# EAGLE design Grove-EMG Sensor v1.0 (EAGLE 6.4)
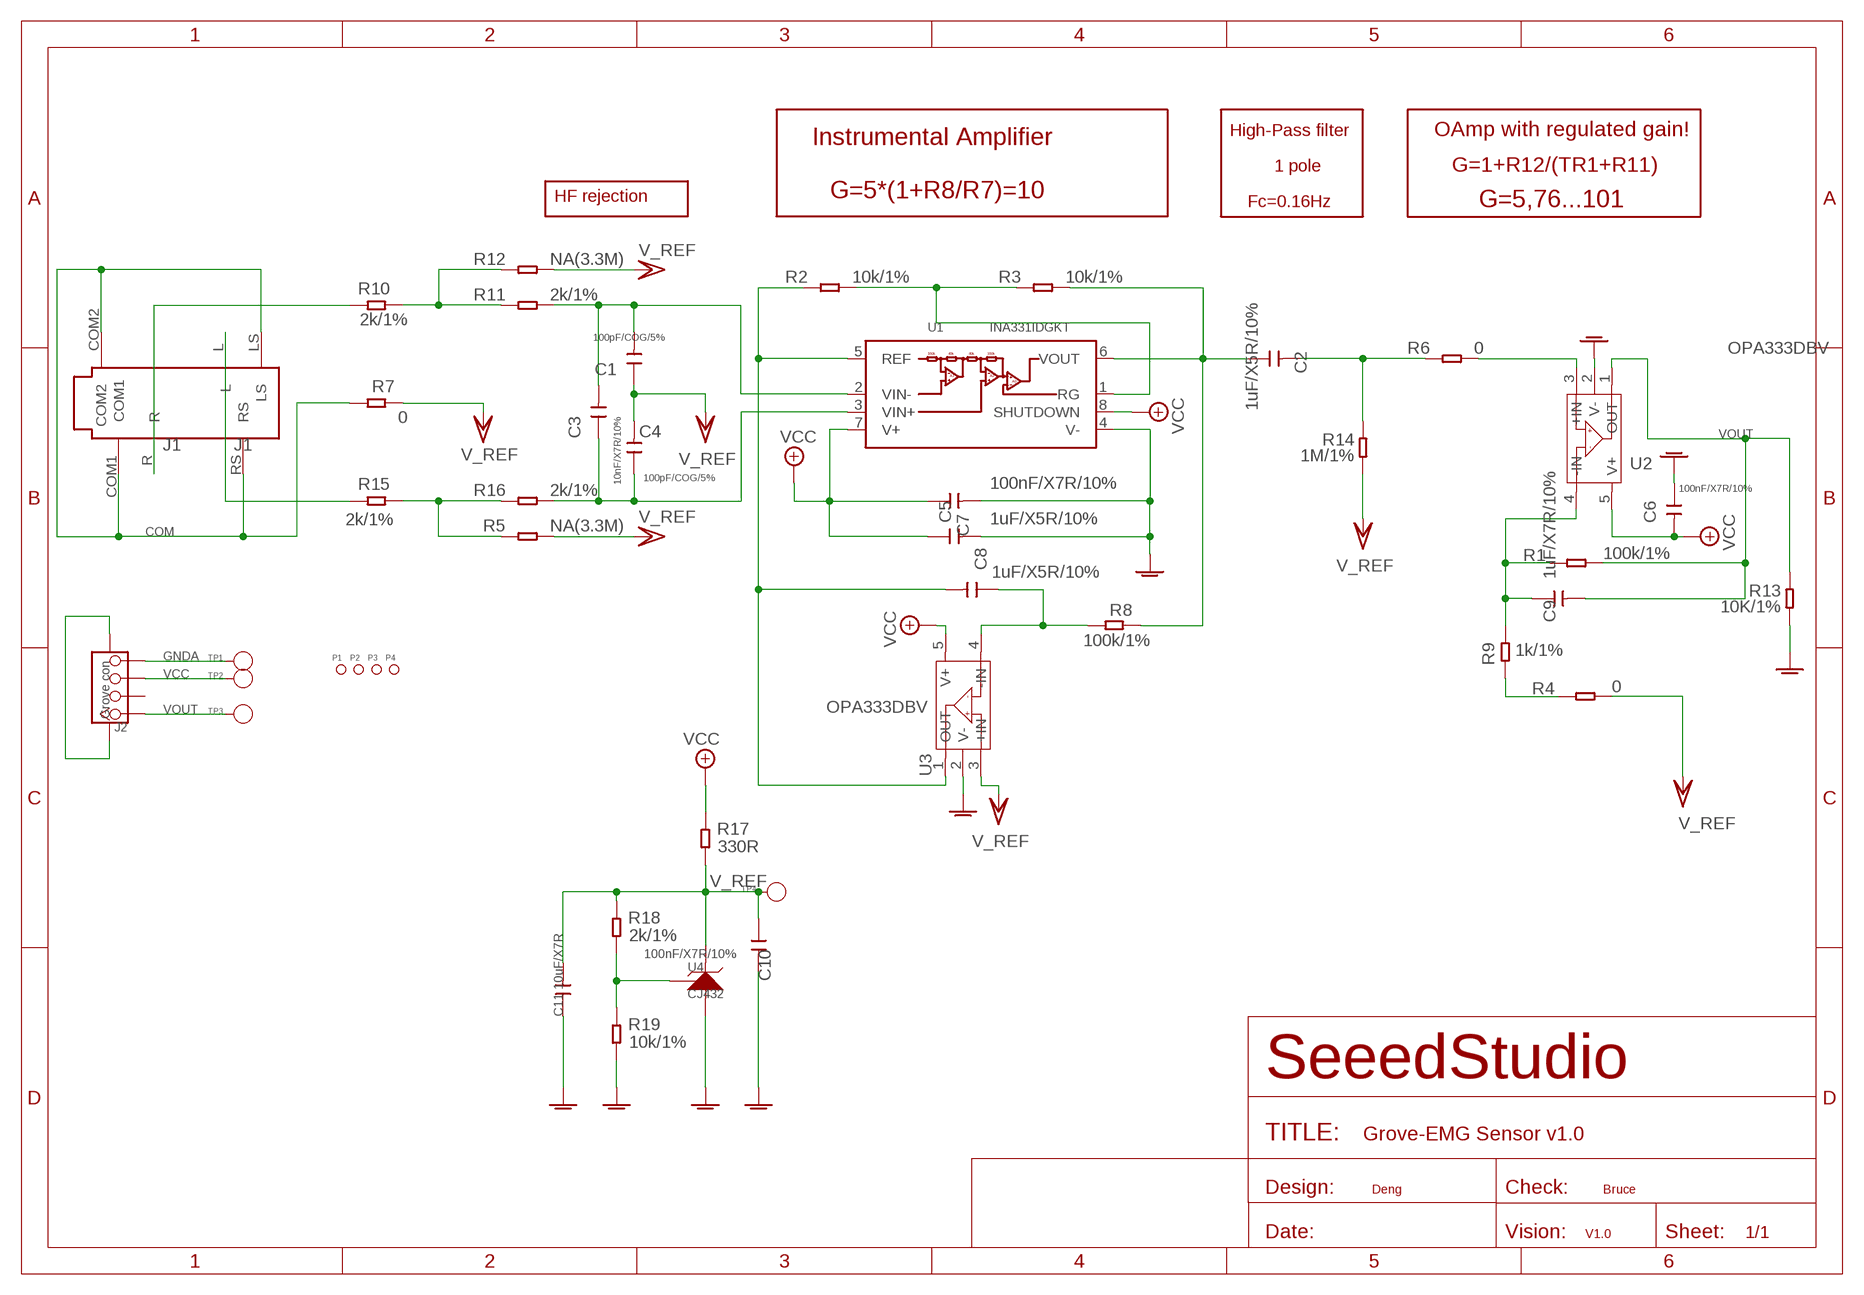
[diagram p0: schematic, sheet 1]

## Parts
C1  100pF/COG/5%  C-0603  [C0603]
C2  1uF/X5R/10%  C-0603  [C0603]
C3  10nF/X7R/10%  C-0603  [C0603]
C4  100pF/COG/5%  C-0603  [C0603]
C5  100nF/X7R/10%  C-0603  [C0603]
C6  100nF/X7R/10%  C-0603  [C0603]
C7  1uF/X5R/10%  C-0603  [C0603]
C8  1uF/X5R/10%  C-0603  [C0603]
C9  1uF/X7R/10%  C-0603  [C0603]
C10  100nF/X7R/10%  C-0603  [C0603]
C11  10uF/X7R  C-0805  [C0805]
J1  J1  AUDIO-6P-SMD  [6P-SMD-3.5-NEW]
J2  Grove con  TWIG-4P-2.0-SMD-FEMALE-REINFORCE'DD'  [4P-SMD-2.0]
P1  PAD-MARK  [ROUND-MARK-1.0]
P2  PAD-MARK  [ROUND-MARK-1.0]
P3  PAD-MARK  [ROUND-MARK-1.0]
P4  PAD-MARK  [ROUND-MARK-1.0]
R1  100k/1%  R-0603  [R0603]
R2  10k/1%  R-0603  [R0603]
R3  10k/1%  R-0603  [R0603]
R4  0  R-0603  [R0603]
R5  NA(3.3M)  R-0603  [R0603]
R6  0  R-0603  [R0603]
R7  0  R-0603  [R0603]
R8  100k/1%  R-0603  [R0603]
R9  1k/1%  R-0603  [R0603]
R10  2k/1%  R-0603  [R0603]
R11  2k/1%  R-0603  [R0603]
R12  NA(3.3M)  R-0603  [R0603]
R13  10K/1%  R-0603  [R0603]
R14  1M/1%  R-0603  [R0603]
R15  2k/1%  R-0603  [R0603]
R16  2k/1%  R-0603  [R0603]
R17  330R  R-0603  [R0603]
R18  2k/1%  R-0603  [R0603]
R19  10k/1%  R-0603  [R0603]
TP1  TP1  PAD-TEST-POINT'4545'  [TP_4545]
TP2  TP2  PAD-TEST-POINT'4545'  [TP_4545]
TP3  TP3  PAD-TEST-POINT'4545'  [TP_4545]
TP4  TP4  PAD-TEST-POINT'4545'  [TP_4545]
U1  INA331IDGKT  INA331EA  [MSOP-8]
U2  OPA333DBV  [SOT23-5]
U3  OPA333DBV  [SOT23-5]
U4  CJ432  REFERENCE-SOURCE  [SOT23]

## Nets
COM: J1.COM1 J1.COM2 J1.LS J1.RS R7.1
GNDA [pwr]: C5.2 C6.1 C7.2 C10.2 C11.1 J2.4 R13.2 R19.1 TP1.T U1.4(V-) U2.2(V-) U3.2(V-) U4.3(A)
N$1: R4.1 R9.2
N$2: C8.1 R8.1 U3.4(-IN)
N$3: J1.R R10.1
N$4: J1.L R15.1
N$7: R10.2 R11.2 R12.2
N$8: R5.2 R15.2 R16.2
N$9: C8.2 R2.2 U1.5(REF) U3.1(OUT)
N$10: R2.1 R3.2 U1.1(RG)
N$20: C2.2 R6.2 R14.1
N$22: R18.1 R19.2 U4.1(R)
N$83: C2.1 R3.1 R8.2 U1.6(VOUT)
N$92: C3.1 C4.1 R16.1 U1.3(VIN+)
N$93: C1.2 C3.2 R11.1 U1.2(VIN-)
N$102: R6.1 U2.3(+IN)
N$105: C9.1 R1.1 R9.1 U2.4(-IN)
V_REF: C1.1 C4.2 C10.1 C11.2 J2.SS1 J2.SS2 R4.2 R5.1 R7.2 R12.1 R14.2 R17.1 R18.2 TP4.T U3.3(+IN) U4.2(K)
VCC: C5.1 C6.2 C7.1 J2.3 R17.2 TP2.T U1.7(V+) U1.8(SHUTDOWN) U2.5(V+) U3.5(V+)
VOUT: C9.2 J2.1 R1.2 R13.1 TP3.T U2.1(OUT)
Unconnected: J2.2

## Notes on the sheet
- High-Pass filter | OAmp with regulated gain!
- Instrumental Amplifier
- 1 pole | G=1+R12/(TR1+R11)
- HF rejection
- G=5*(1+R8/R7)=10
- Fc=0.16Hz | G=5,76...101
- Deng | Bruce
- V1.0

## Library data of the parts
C1-C11 = Discrete:C*: Ceramic Capacitors
J1 = Connector :AUDIO-6P-SMD
J2 = Connector :TWIG-4P-2.0-SMD-FEMALE-REINFORCE
P1-P4 = Discrete:PAD-MARK; PARTNO: DNP
R1-R19 = Discrete:R*
TP1-TP4 = Discrete:PAD-TEST-POINT; PARTNO: DNP
U1 = template:INA331
U2 U3 = IC:OPA333: 1.8V,Micro power CMOS oprational amplifiers Zero-Drift Series http://www.ti.com.cn/cn/lit/ds/symlink/opa333.pdf
U4 = For_Test_Albert_v6:REFERENCE-SOURCE: CJ432,AZ432 or other Adjustable Reference Source

## Net classes
0 default: width 0.152 mm, drill 0.305 mm, clearance 0.152 mm
1 pwr: width 0.152 mm, drill 0.305 mm, clearance 0.152 mm

## Board
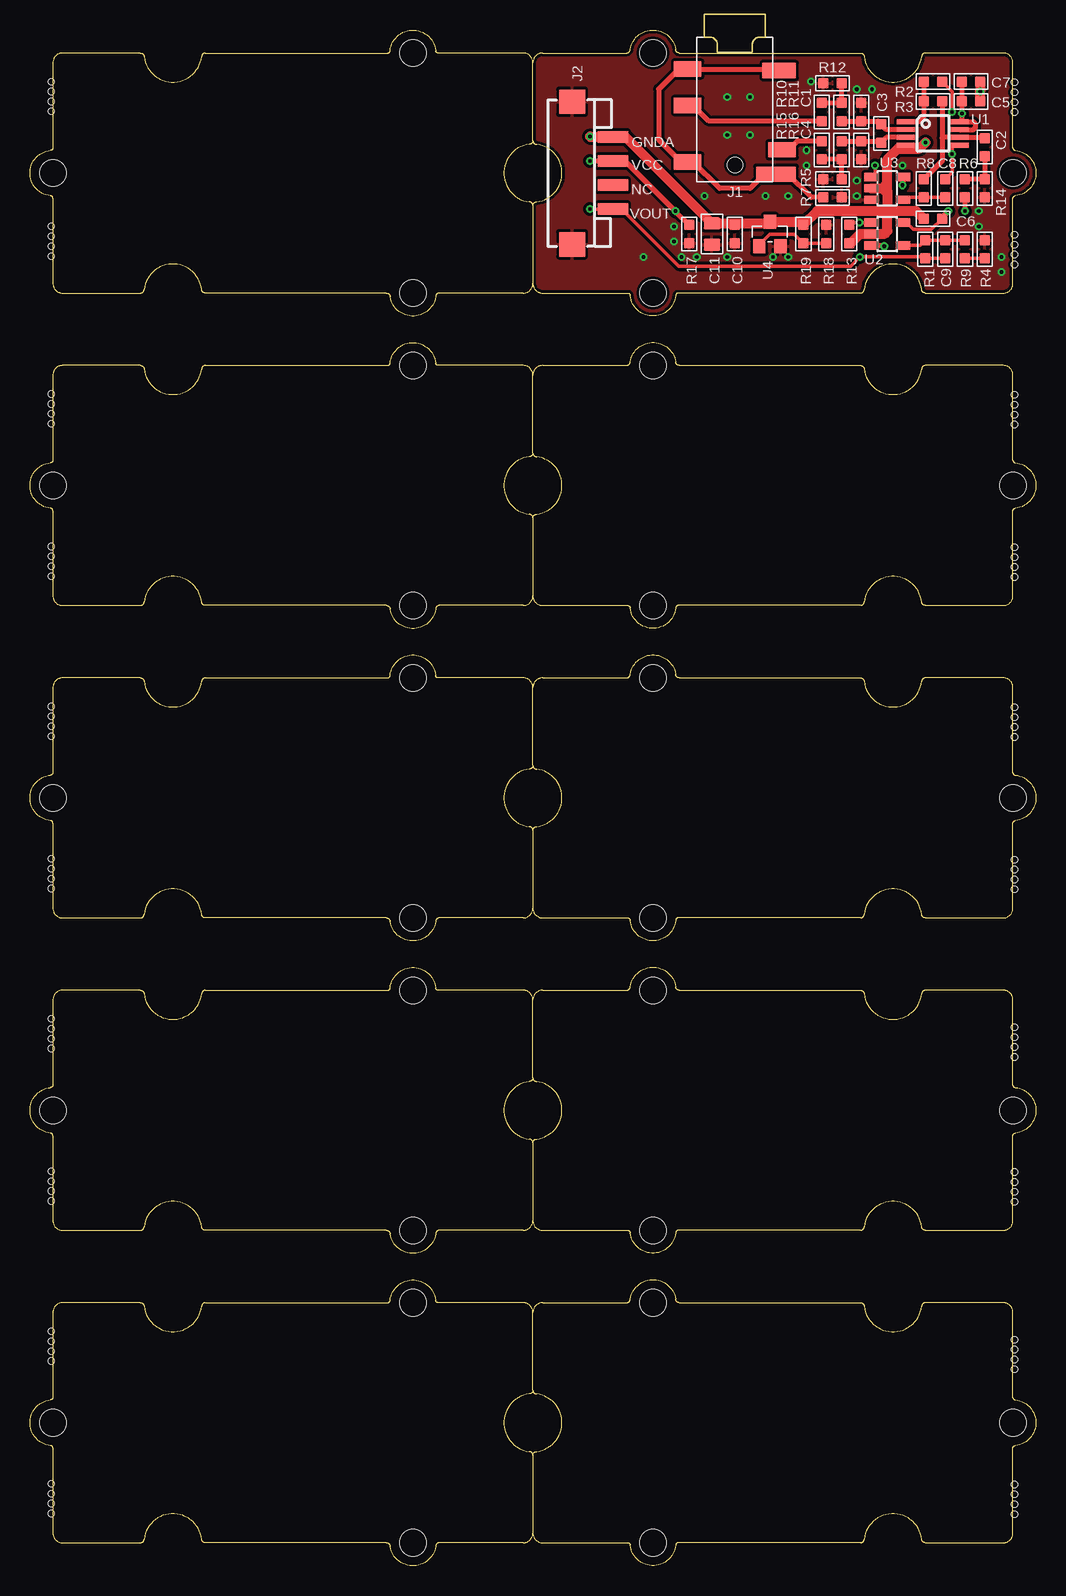
[diagram p1: board, top side]
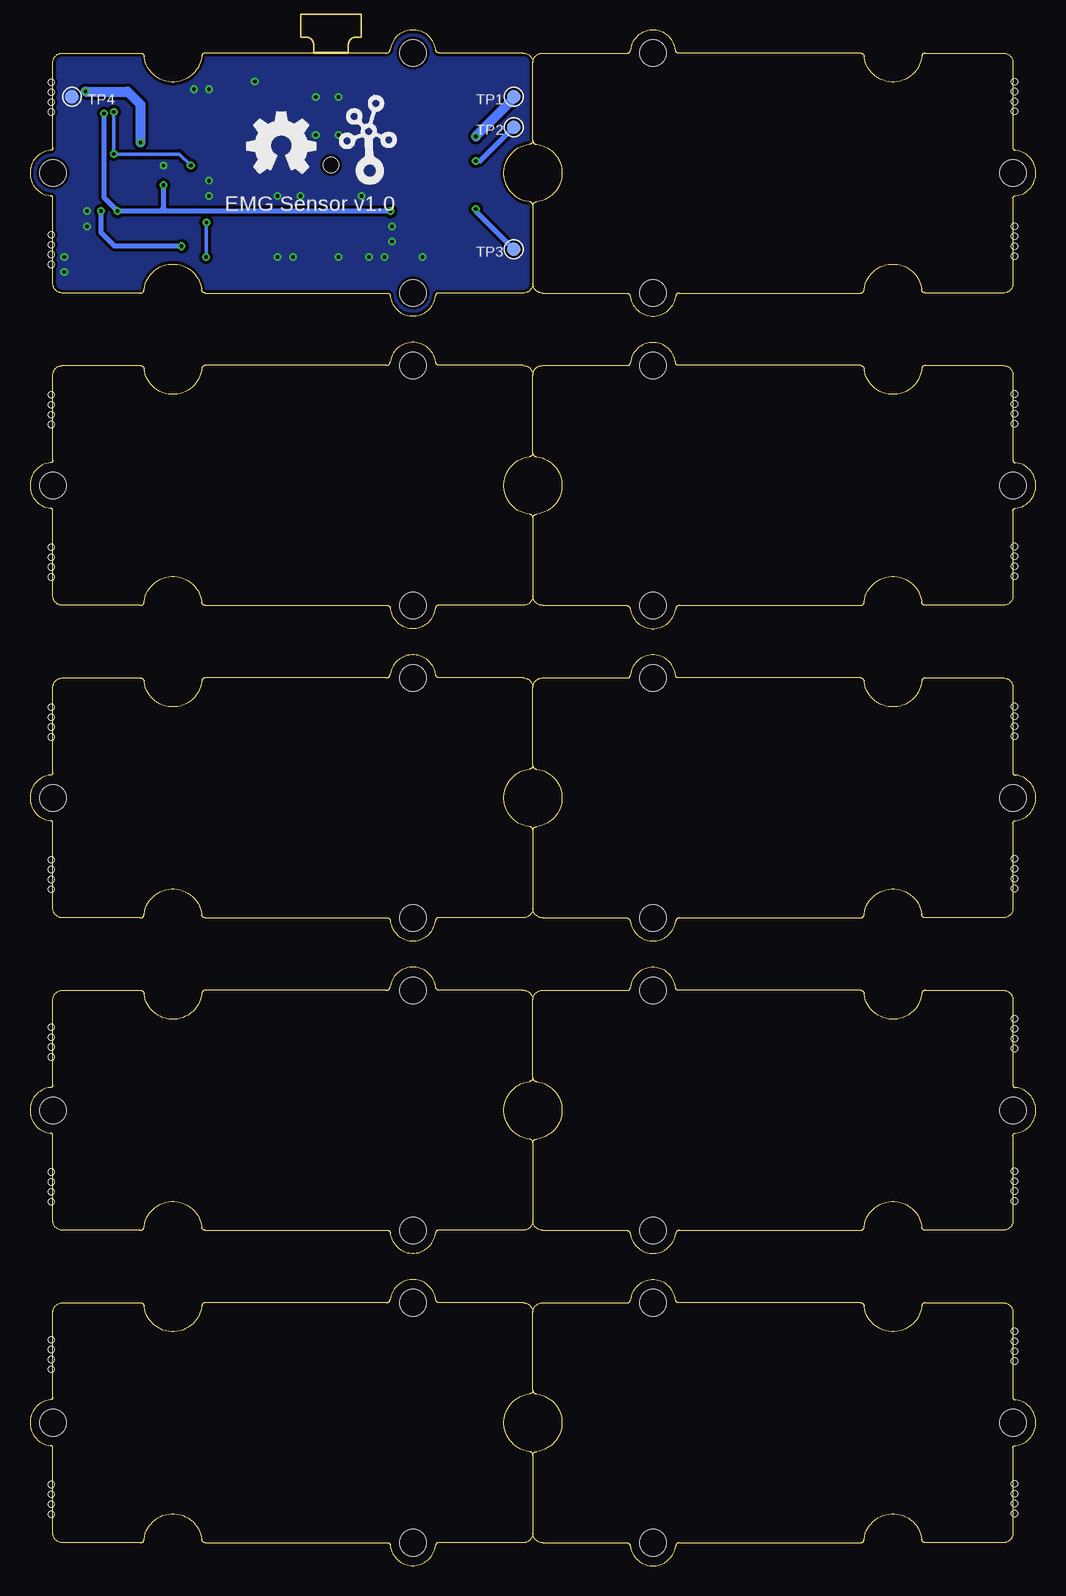
[diagram p2: board, bottom side, seen from below]

Size 83.82 x 127.98 mm. Coordinates in mm from the lower left corner, seen from the top.
Copper layers (1*16): Top 0.035mm / dielectric 1.5mm / Bottom 0.035mm
Design rules "SeeedStudio_DRU_no_angle_20130527 *": minimum track width 6mil, minimum drill 12mil, track to track 6mil, track to pad 6mil, pad to pad 6mil, via to via 6mil, smd to smd 0mil, copper to edge 10mil, drill to drill 10mil, minimum pad ring 10mil, minimum via ring 6mil, stop-mask expansion 2mil, vias tented up to drill 25mil, thermal gap 10mil
Holes 0.5 mm at 1.78,32.88 1.78,30.4 1.78,31.23 1.78,32.05 1.78,45.58 1.78,43.1 1.78,43.93 1.78,44.75 1.78,58.91 1.78,56.43 1.78,57.26 1.78,58.09 1.78,71.61 1.78,69.13 1.78,69.96 1.78,70.79 1.78,84.95 1.78,82.47 1.78,83.3 1.78,84.12 1.78,97.65 1.78,95.17 1.78,96 1.78,96.82 1.78,111.62 1.78,109.14 1.78,109.97 1.78,110.79 1.78,123.68 1.78,121.2 1.78,122.03 1.78,122.86 82.04,121.14 82.04,123.62 82.04,122.79 82.04,121.97 82.04,108.44 82.04,110.92 82.04,110.09 82.04,109.27 82.04,95.11 82.04,97.58 82.04,96.76 82.04,95.93 82.04,82.41 82.04,84.88 82.04,84.06 82.04,83.23 82.04,69.07 82.04,71.55 82.04,70.72 82.04,69.9 82.04,56.37 82.04,58.85 82.04,58.02 82.04,57.2 82.04,42.4 82.04,44.88 82.04,44.05 82.04,43.23 82.04,30.34 82.04,32.81 82.04,31.99 82.04,31.16 1.78,6.84 1.78,4.36 1.78,5.19 1.78,6.02 1.78,19.54 1.78,17.06 1.78,17.89 1.78,18.72 82.04,16.37 82.04,18.84 82.04,18.02 82.04,17.19 82.04,4.3 82.04,6.78 82.04,5.95 82.04,5.13
Holes 1.91 mm at -4.13,2.4 87.95,2.4 87.95,125.59 -4.13,125.59

### Footprints (pad centres in the part's own frame; a part is rotated, then mirrored left to right if it is on the bottom)
C0603 = smd 0.889 x 0.889: 1 -0.762,0; 2 0.762,0
C0805 = smd 1.016 x 1.397: 1 -0.889,0; 2 0.889,0
6P-SMD-3.5-NEW = smd 1.27 x 2.286: COM1 -4.572,3.937; L -11.303,-3.937; R -7.62,3.937; RS -12.319,3.937 | smd 1.27 x 2.794: COM2 -4.699,-3.683 | smd 1.27 x 3.302: LS -13.335,-3.429 | hole 1.27: -12.573,0
4P-SMD-2.0 = smd 0.965 x 2.54: 1 -3,0; 2 -1,0; 3 1,0; 4 3,0 | smd 2.032 x 2.184: SS1 -5.946,3.4; SS2 5.946,3.4
ROUND-MARK-1.0 = smd 1.016 x 1.016: P$1 0,0
R0603 = smd 0.889 x 0.889: 1 -0.762,0; 2 0.762,0
TP_4545 = smd 1.143 x 1.143: T 0,0
MSOP-8 = smd 0.4 x 1.5: 1 -0.975,-2.25; 2 -0.325,-2.25; 3 0.325,-2.25; 4 0.975,-2.25; 5 0.975,2.25; 6 0.325,2.25; 7 -0.325,2.25; 8 -0.975,2.25
SOT23-5 = smd 0.69 x 1.2: 1 -0.95,-1.3; 2 0,-1.3; 3 0.95,-1.3; 4 0.95,1.3; 5 -0.95,1.3
SOT23 = smd 1.016 x 1.143: 1 -0.889,-1.016; 2 0.889,-1.016; 3 0,1.016
GROVE-TEST-PLATFORM = hole 2.2: -10,-10; -10,10; 20,0

### Placement (x,y rotation side)
C1  69.28,121.14 270 top
C2  79.57,118.22 270 top
C3  70.93,119.36 90 top
C4  69.28,117.97 270 top
C5  78.42,122.03 0 top
C6  75.25,112.25 0 top
C7  78.42,123.68 0 top
C8  76.26,114.79 90 top
C9  76.26,109.71 270 top
C10  58.74,110.98 90 top
C11  56.83,110.98 270 top
J1  58.74,129.3 90 top
J2  48.58,116.06 90 top
P1  -4.13,120.51 0 top  (outside the outline)
P2  -4.13,7.48 0 top  (outside the outline)
P3  87.95,120.51 0 top  (outside the outline)
P4  87.95,7.48 0 top  (outside the outline)
R1  74.61,109.71 270 top
R2  75.25,123.68 0 top
R3  75.25,122.03 180 top
R4  79.57,109.71 90 top
R5  66.87,115.55 0 top
R6  77.92,114.79 90 top
R7  66.87,114.03 0 top
R8  74.49,114.79 90 top
R9  77.92,109.71 270 top
R10  65.98,121.14 90 top
R11  67.63,121.14 90 top
R12  66.87,123.55 0 top
R13  68.26,110.98 270 top
R14  79.57,114.79 270 top
R15  65.98,117.97 270 top
R16  67.63,117.97 270 top
R17  54.93,110.98 90 top
R18  66.36,110.98 90 top
R19  64.45,110.98 270 top
TP1  43.5,122.41 0 bottom
TP2  43.5,119.87 0 bottom
TP3  43.5,109.71 0 bottom
TP4  80.33,122.41 0 bottom
U1  75.25,119.36 270 top
U2  71.44,110.98 270 top
U3  71.44,114.79 270 top
U4  61.66,110.98 0 top
U$2  [GROVE-TEST-PLATFORM]  61.91,116.06 0 top
U$3  [OSHW_FILLX200_NOTEXT]  65.72,116.06 0 bottom
U$4  [TWIGLOGO]  55.56,116.06 0 bottom
U$5  [GROVE-TEST-PLATFORM]  21.91,116.06 180 top
U$6  [GROVE-TEST-PLATFORM]  21.91,90.03 180 top
U$7  [GROVE-TEST-PLATFORM]  61.91,90.03 0 top
U$8  [GROVE-TEST-PLATFORM]  21.91,63.99 180 top
U$9  [GROVE-TEST-PLATFORM]  61.91,63.99 0 top
U$10  [GROVE-TEST-PLATFORM]  21.91,37.96 180 top
U$11  [GROVE-TEST-PLATFORM]  61.91,37.96 0 top
U$12  [GROVE-TEST-PLATFORM]  21.91,11.92 180 top
U$13  [GROVE-TEST-PLATFORM]  61.91,11.92 0 top

### Tracks (layer width: path | path; a pad name or v marks a point on that pad's centre or on a via)
COM
  Top 0.406: J1.COM2 62.29,124.73 J1.COM1 54.07,124.73 52.39,123.05 52.39,118.86 54.26,116.98 J1.RS 55.28,116.98 57.47,114.79 60.01,114.79 61.18,115.97 J1.LS 63.15,115.97 65.09,114.03 R7.1
GNDA  (via drill 0.3 pad 0.64)
  Top 0.406: R13.2 68.14,110.22 | 72.45,118.22 72.62,118.39 U1.4 74.4,118.39 v74.61,118.6
  Top 0.813: 58.61,111.87 C11.1 49.64,119.06 48.83,119.06 J2.4 46.72,119.06 v46.67,119.11 | 58.61,111.87 C10.2 | R13.2 68.39,110.22 69.15,110.98 U2.2 71.18,110.98 71.44,111.24 71.44,112.51 | 58.61,111.87 61.53,111.87 U4.3 64.2,112 R19.1 65.6,112.89 71.06,112.89 | 71.82,112.89 73.85,112.89 C6.1 | 71.82,112.89 71.57,112.89 | 71.57,112.89 71.06,112.89 | 71.44,112.51 71.44,113.01 | 71.44,114.54 71.18,114.79 71.06,114.79 | U3.2 71.06,114.79 | 71.44,114.54 71.44,117.2 72.33,118.09 74.11,118.09 v74.61,118.6 | C7.2 v79.19,122.86 C5.2 | 71.44,114.54 71.44,113.27 | 71.44,113.27 71.44,113.01 | 71.44,113.01 71.57,112.89 | 71.06,114.79 71.31,115.05 | 71.06,114.79 71.31,114.54 | 71.06,112.89 71.44,113.27 | 71.44,113.27 71.82,112.89 | 71.82,112.89 71.44,112.51 | 71.44,112.51 71.18,112.76
  Bottom 0.813: v74.61,118.6 74.61,121.78 75.69,122.86 v79.19,122.86 | TP1.T 43.5,122.28 v46.67,119.11
N$1
  Top 0.305: R4.1 R9.2
N$2
  Top 0.305: C8.1 R8.1 72.93,114.03 U3.4
N$3
  Top 0.406: R10.1 56.58,120.38 55.28,121.68 J1.R
N$4
  Top 0.406: R15.1 63.95,118.73 63.22,118 J1.L
N$7
  Top 0.406: R10.2 R11.2 R12.2
N$8
  Top 0.406: R5.2 R16.2 R15.2
N$9  (via drill 0.3 pad 0.64)
  Top 0.305: R2.2 76.84,122.86 v76.84,121.14 | C8.2 76.84,116.13 v76.84,117.65 76.84,118.35 76.88,118.39 U1.5 | v70.42,116.7 70.42,116.03 U3.1
  Bottom 0.305: v76.84,121.14 v76.84,117.65 71.37,117.65 v70.42,116.7
N$10
  Top 0.406: U1.1 74.06,120.34 74.49,120.76 R3.2 R2.1
N$20
  Top 0.406: C2.2 R14.1 R6.2
N$22
  Top 0.305: U4.1 60.77,110.09 61.66,110.98 63.69,110.98 R19.2 R18.1
N$83
  Top 0.406: C2.1 79.51,119.04 U1.6 76.07,119.04 76.01,118.98 | R3.1 76.01,118.98 | 76.01,118.98 76.01,117.08 R8.2
N$92
  Top 0.406: U1.3 71.37,119.04 C3.1 70.8,118.73 C4.1 R16.1
N$93
  Top 0.406: U1.2 71.37,119.69 C3.2 70.68,120.38 C1.2 R11.1
N$102  (via drill 0.3 pad 0.64)
  Top 0.406: R6.1 v77.92,112.89 | U2.3 71.12,110.03 v71.18,109.97
  Bottom 0.406: v77.92,112.89 77.92,111.11 76.77,109.97 v71.18,109.97
N$105
  Top 0.305: R9.1 C9.1 R1.1 74.17,110.03 U2.4
V_REF  (via drill 0.3 pad 0.64)
  other vias: 79.06,112.89 61.91,109.08 63.18,109.08 58.1,109.08 55.56,109.08 54.29,109.08 53.66,110.35 58.1,122.41 60.01,122.41 68.9,115.43 64.71,117.97 64.71,116.7 68.9,114.16 65.09,123.68 68.9,123.05 70.17,123.05 79.06,111.62 80.96,109.08 80.96,107.81 58.1,119.24 60.01,119.24 51.12,109.08 53.66,111.62 63.18,114.16 61.28,114.16 56.2,114.16 72.71,116.7
  pour Bottom (isolate 0.254): 41.59,128.13 84.14,128.13 84.14,104.63 84.14,104 41.59,104
  pour Top (isolate 0.254): 41.59,128.13 84.14,128.13 84.14,104.63 84.14,104 41.59,104
VCC  (via drill 0.3 pad 0.64)
  Top 0.305: U3.5 72.52,115.74 | 72.52,112.06 72.52,111.93 U2.5 73.03,111.93 73.6,111.36 75.12,111.36 C6.2
  Top 0.406: U1.7 78.62,119.69 78.8,119.87 78.8,120.13 78.59,120.34 U1.8 77.66,120.5 v77.66,121.01 C5.1 | 77.5,121.87 C5.1 | C7.1 C5.1 | v46.67,117.08 46.69,117.06 J2.3 49.61,117.06 v53.79,112.89 R17.2 | U3.5 72.74,115.08 v72.71,115.05 | C6.2 76.01,112.38 v76.52,112.89
  Bottom 0.406: v46.67,117.08 46.29,117.08 TP2.T | v77.66,121.01 77.66,114.03 v76.52,112.89 72.96,112.89 | v53.79,112.89 72.45,112.89 | 72.45,112.89 72.58,112.89 | 72.58,112.89 72.96,112.89 | v72.71,115.05 72.71,113.27 72.71,113.14 | 72.71,113.14 72.71,113.01 72.58,112.89 | 72.71,113.14 72.96,112.89 | 72.71,113.14 72.45,112.89
VOUT  (via drill 0.3 pad 0.64)
  Top 0.305: C9.2 R1.2 74.49,109.08 v69.15,109.08 68.38,108.3 54.05,108.3 49.29,113.06 48.88,113.06 J2.1 46.69,113.06 v46.67,113.08 | U2.1 v69.13,111.93 68.45,111.93 R13.1
  Bottom 0.305: v69.15,109.08 69.15,111.91 v69.13,111.93
  Bottom 0.406: v46.67,113.08 46.67,112.89 TP3.T

### Text on the board
tPlace: GNDA | VCC | NC | VOUT
bPlace: EMG Sensor v1.0